# EAGLE design moduleV08 (EAGLE 9.4.2)
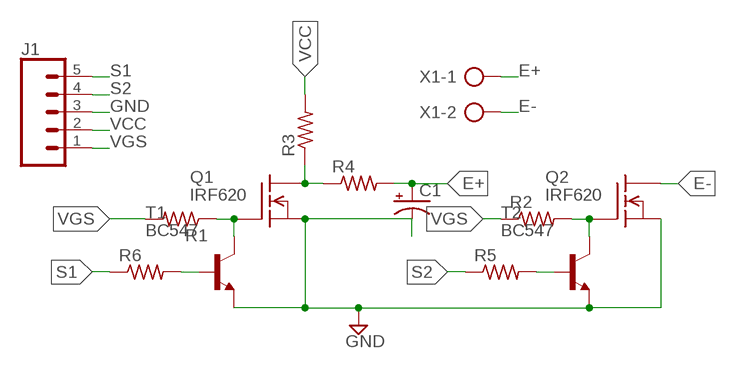
[diagram p0: schematic, sheet 1]

## Parts
C1  CAPACITOR-PE3.5-8  [E3,5-8]
J1  CONN_05  [1X05]
Q1  IRF620  [TO220]
Q2  IRF620  [TO220]
R1  R-US_0204/7  [0204/7]
R2  R-US_0204/7  [0204/7]
R3  R-US_0204/7  [0204/7]
R4  R-US_0204/7  [0204/7]
R5  R-US_0204/7  [0204/7]
R6  R-US_0204/7  [0204/7]
T1  BC547  [TO92]
T2  BC547  [TO92]
X1  AK500/2-H  [AK500/2-H]

## Nets
E+: C1.+ R4.2 X1.1
E-: Q2.2(D) X1.2
GND: C1.- J1.3 Q1.3(S) Q2.3(S) T1.1(E) T2.1(E)
N$1: Q1.1(G) R1.1 T1.3(C)
N$2: R6.2 T1.2(B)
N$3: Q1.2(D) R3.1 R4.1
N$6: R5.2 T2.2(B)
N$7: Q2.1(G) R2.2 T2.3(C)
S1: J1.5 R6.1
S2: J1.4 R5.1
VCC: J1.2 R3.2
VGS: J1.1 R1.2 R2.1

## Library data of the parts
C1 = BeagleBone_Blue_R3:CAPACITOR-P: POLARIZED CAPACITOR, American symbol
J1 = SparkFun-Connectors:CONN_05: Multi connection point. Often used as Generic Header-pin footprint for 0.1 inch spaced/style header connections On any of the 0.1 inch spaced packages, you can populate with these: Break Away Headers - Straight <https://www.sparkfun.com/products/116> (PRT-00116) Break Away Male Headers - Right Angle <https://www.sparkfun.com/products/553> (PRT-00553) Female Headers <https://www.sparkfun.com/products/115> (PRT-00115) Break Away Headers - Machine Pin <https://www.sparkfun.com/products/117> (PRT-00117) Break Away Female Headers - Swiss Machine Pin <https://www.sparkfun.com/products/743> (PRT-00743) For SCREWTERMINALS and SPRING TERMINALS visit here: Screw Terimnals on SparkFun.com <https://www.sparkfun.com/search/results?term=Screw+Terminals> (5mm/3.5mm/2.54mm spacing) This device is also useful as a general connection point to wire up your design to another part of your project. Our various solder wires solder well into these plated through hole pads. Hook-Up Wire - Assortment (Stranded, 22 AWG) <https://www.sparkfun.com/products/11375> (PRT-11375) Hook-Up Wire - Assortment (Solid Core, 22 AWG) <https://www.sparkfun.com/products/11367> (PRT-11367) View the entire wire category on our website here <https://www.sparkfun.com/categories/141> Special notes: Molex polarized connector foot print use with SKU : PRT-08231 with associated crimp pins and housings. 1MM SMD Version SKU: PRT-10208
Q1 Q2 = transistor-fet:IRF620: N-Channel Enhancement MOSFET (HEXFET); 200V; 5,2A; 0,8Ohm
R1-R6 = BeagleBone_Black_Wireless:R-US_: RESISTOR, American symbol
T1 T2 = transistor:BC547: NPN TRANSISTOR
X1 = con-ptr500:AK500/2-H: CONNECTOR Aug. 2004 / PTR Meßtechnik: Die Bezeichnung der Serie AK505 wurde geändert. Es handelt sich hierbei um AK500 in horizontaler Ausführung.; OC_FARNELL: unknown; OC_NEWARK: unknown

## Board
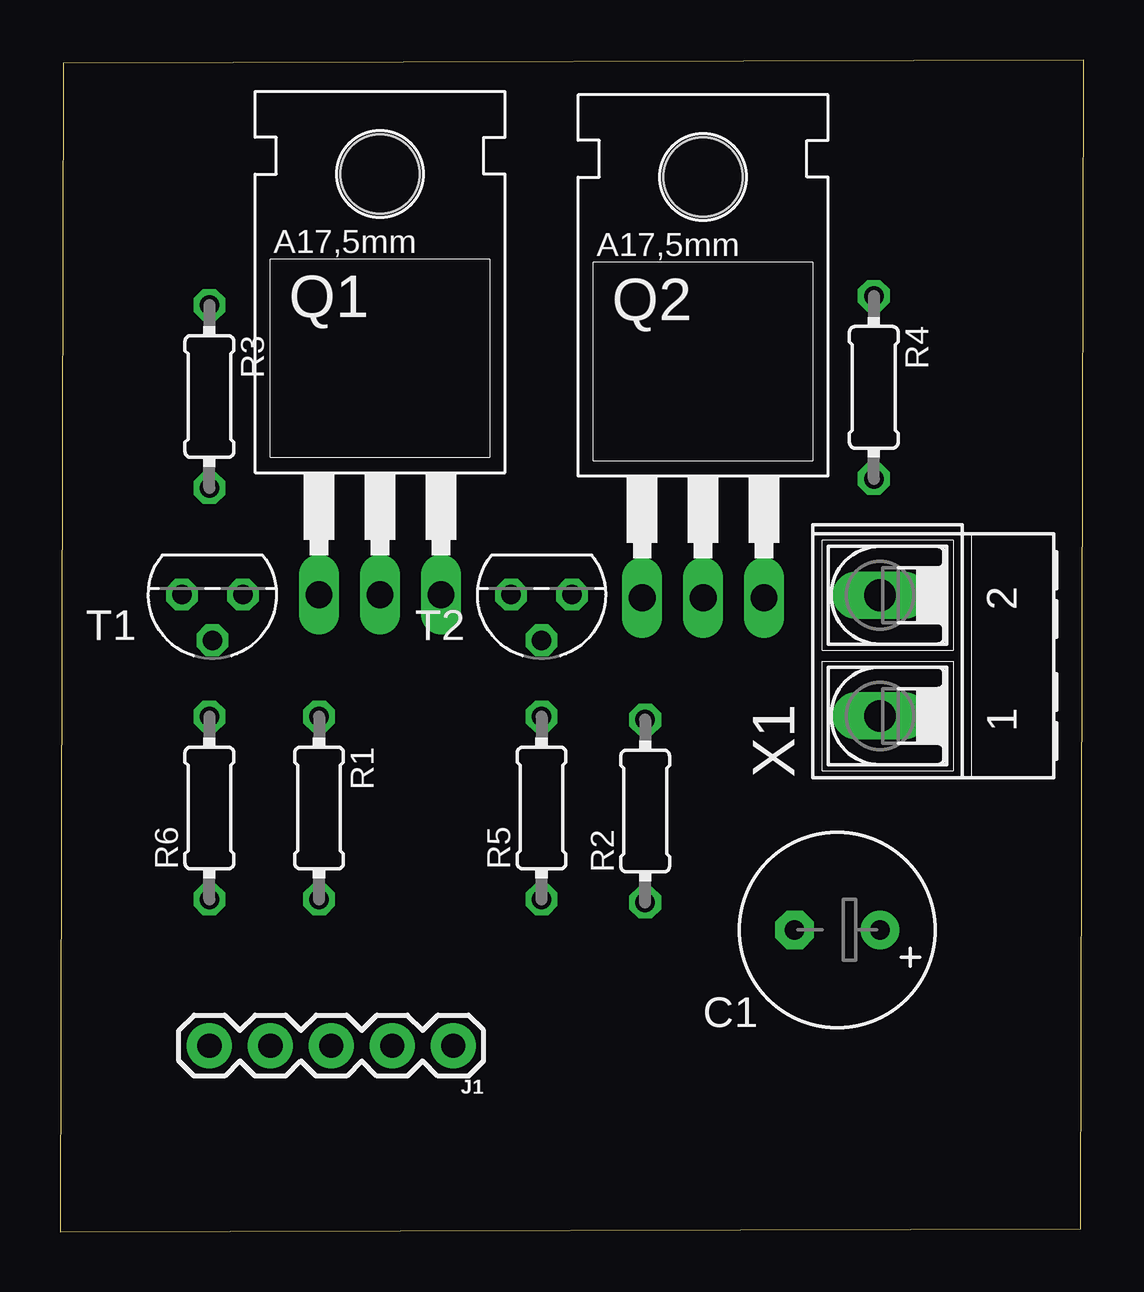
[diagram p1: board, top side]
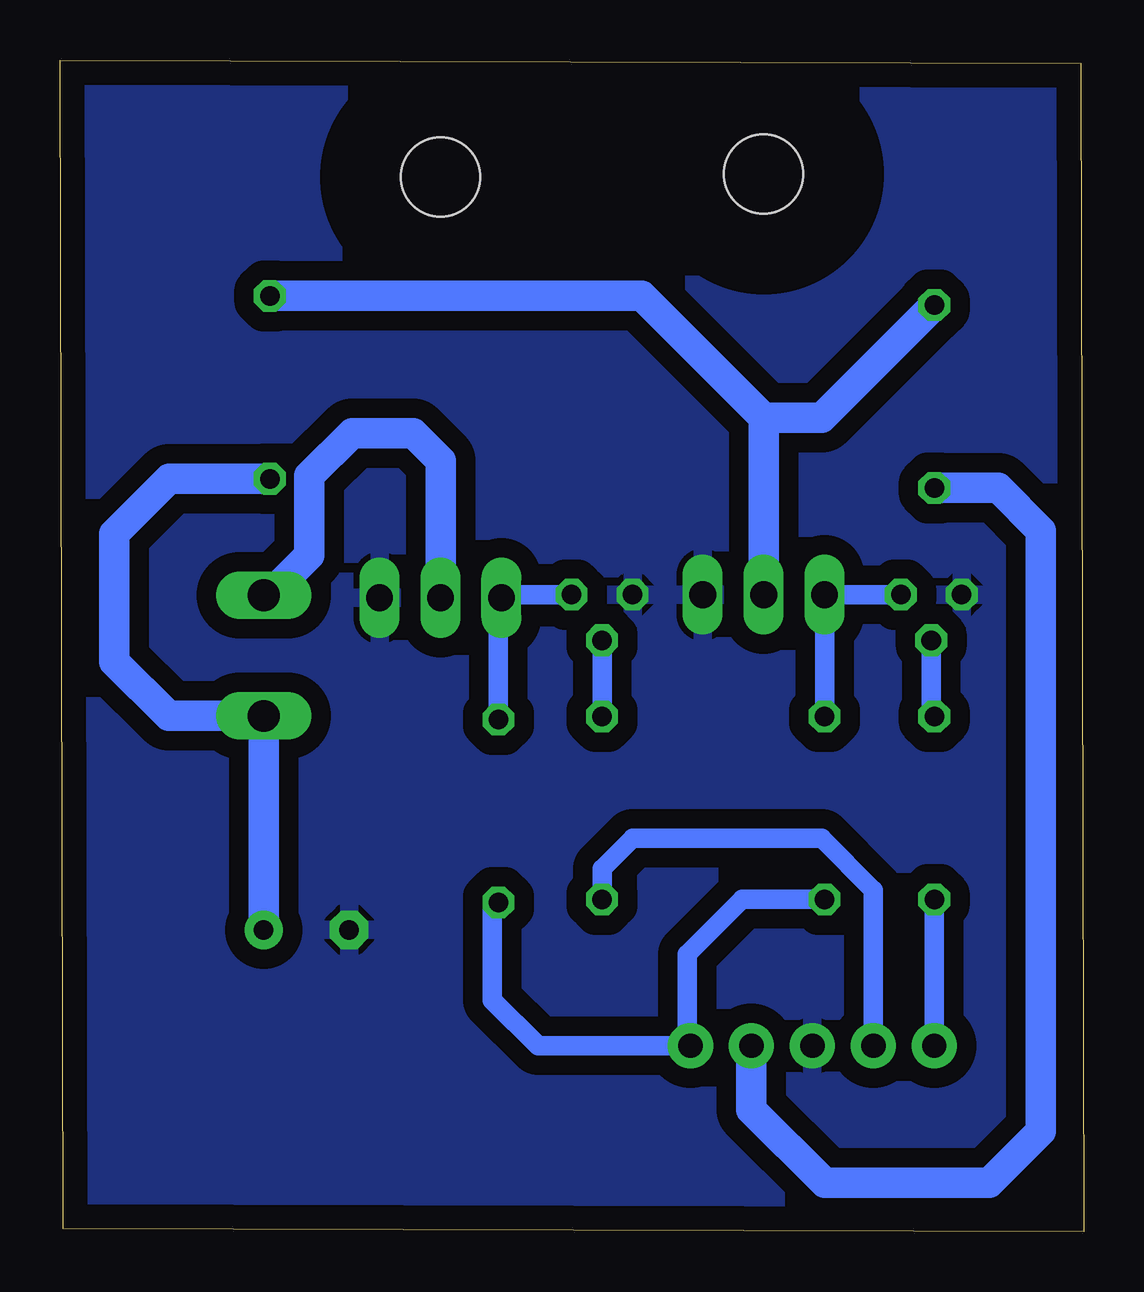
[diagram p2: board, bottom side, seen from below]

Size 42.65 x 48.82 mm. Coordinates in mm from the lower left corner, seen from the top.
Outline: 0,0 42.53,0.13 42.65,48.82 0.13,48.69 0,0
Copper layers (1*16): Top 0.035mm / dielectric 1.5mm / Bottom 0.035mm
Design rules "default": minimum track width 6mil, minimum drill 0.35mm, track to track 6mil, track to pad 6mil, pad to pad 6mil, via to via 6mil, smd to smd 6mil, copper to edge 40mil, drill to drill 6mil, minimum pad ring 10mil, minimum via ring 8mil, stop-mask expansion 4mil, vias tented up to drill 0mil, thermal gap 10mil

### Footprints (pad centres in the part's own frame; a part is rotated, then mirrored left to right if it is on the bottom)
E3,5-8 = drill 0.813 pad 1.6: + -1.778,0 | drill 0.813 pad 1.6 octagon: - 1.778,0
1X05 = drill 1.016 pad 1.88: 1 0,0; 2 2.54,0; 3 5.08,0; 4 7.62,0; 5 10.16,0
TO220 = drill 1.118 long: 1 -2.54,-6.35; 2 0,-6.35; 3 2.54,-6.35 | hole 3.302: 0,11.176
0204/7 = drill 0.813 octagon: 1 -3.81,0; 2 3.81,0
TO92 = drill 0.813 octagon: 1 1.27,0; 2 0,1.905; 3 -1.27,0
AK500/2-H = drill 1.321 long: 1 -2.515,0; 2 2.515,0

### Placement (x,y rotation side)
C1  32.39,12.57 180 top
J1  16.38,7.75 180 top
Q1  13.34,32.89 0 top
Q2  26.8,32.77 0 top
R1  10.79,17.65 270 top
R2  24.38,17.53 90 top
R3  6.22,34.8 270 top
R4  33.91,35.18 270 top
R5  20.07,17.65 90 top
R6  6.22,17.65 90 top
T1  6.35,26.54 180 top
T2  20.07,26.54 180 top
X1  34.16,24 90 top

### Tracks (layer width: path | path; a pad name or v marks a point on that pad's centre or on a via)
E+
  Bottom 1.27: C1.+ X1.1 38.12,21.49 40.39,23.75 40.39,29.08 38.1,31.37 R4.2
E-
  Bottom 1.27: Q2.2 26.8,32.13 27.94,33.27 30.48,33.27 32.26,31.5 32.26,28.19 33.93,26.52 X1.2
GND
  pour Bottom (isolate 0.813): 0,49.02 42.67,49.02 42.8,48.9 42.8,0.38 42.93,0.25 0,0.25
N$1
  Bottom 0.813: T1.3 Q1.1 R1.1
N$2
  Bottom 0.813: T1.2 6.35,21.59 R6.2
N$3
  Bottom 1.27: Q1.2 13.34,33.91 | R4.1 18.41,38.99 13.34,33.91 | R3.1 10.92,33.91 13.34,33.91
N$6
  Bottom 0.813: T2.2 R5.2
N$7
  Bottom 0.813: T2.3 24.13,26.54 Q2.1 24.38,26.29 R2.2
S1
  Bottom 0.813: R6.1 J1.5
S2
  Bottom 0.813: J1.4 8.76,14.22 10.92,16.38 18.8,16.38 20.07,15.11 R5.1
VCC
  Bottom 1.27: R3.2 3.56,30.99 1.78,29.21 1.78,4.19 3.94,2.03 10.79,2.03 13.84,5.08 J1.2
VGS
  Bottom 0.813: 24.51,13.84 R2.1 24.64,13.46 24.64,9.65 22.73,7.75 J1.1 16.51,7.87 16.51,11.56 14.22,13.84 R1.2